# EasyEDA Pro project sfy3-v3.1.4.epro, board PCB_sfy3_1_3
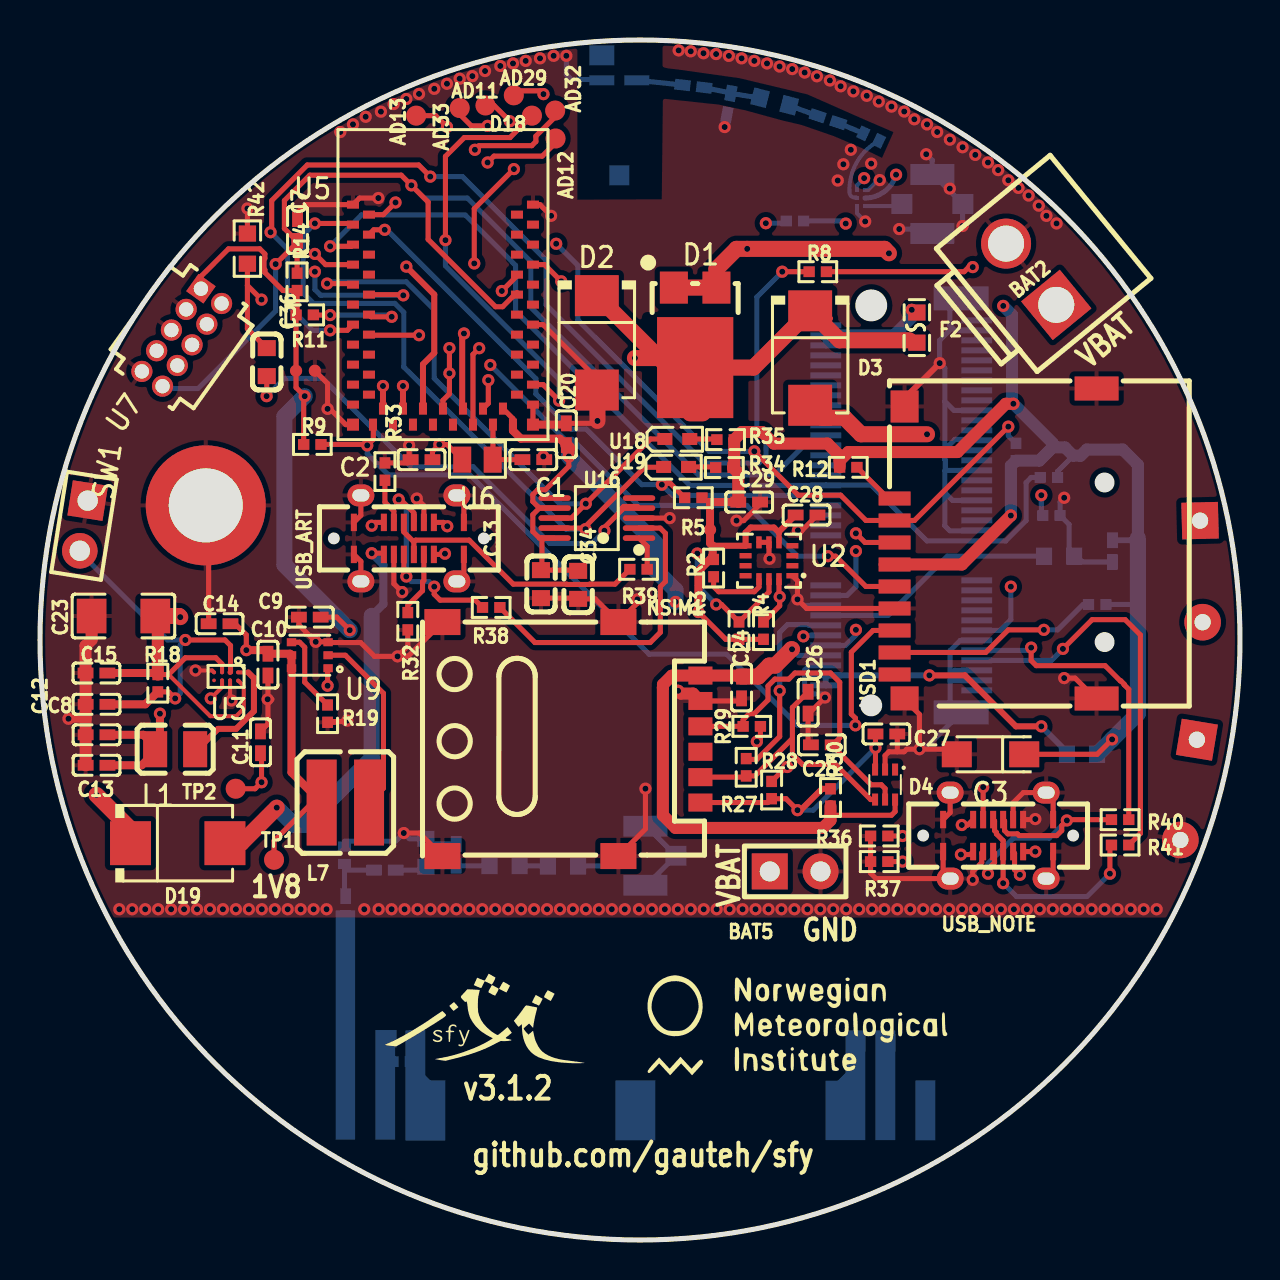
[diagram p36: board, top side]
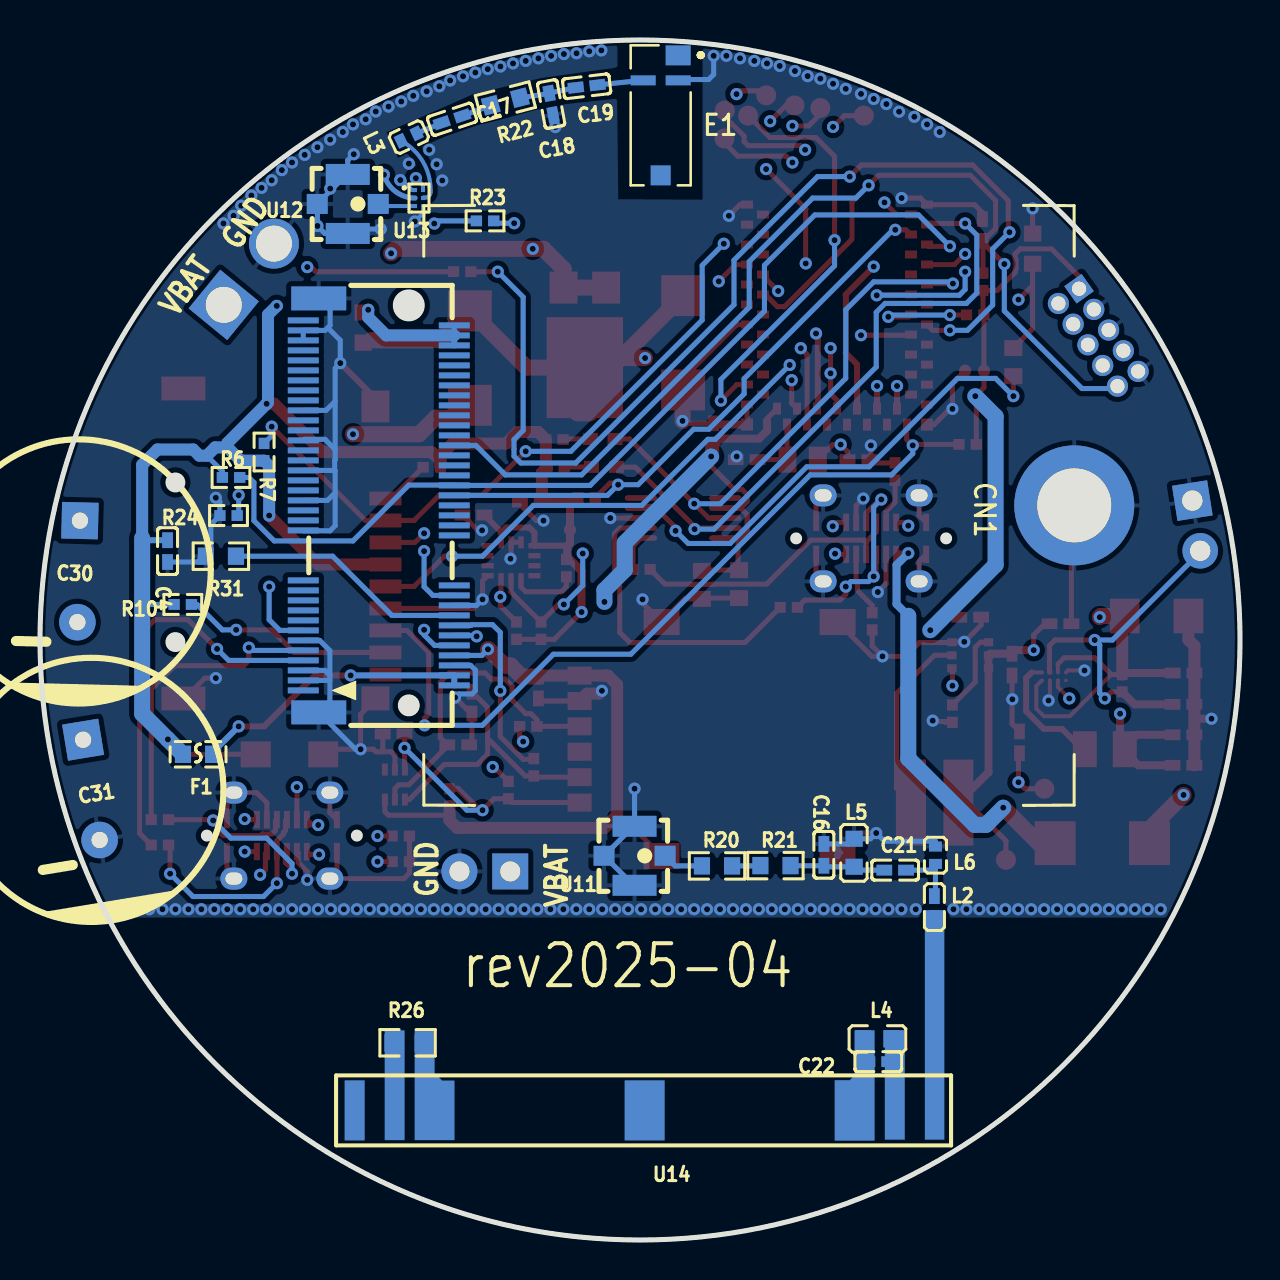
[diagram p37: board, bottom side, seen from below]

Outline 60 x 60 mm; copper layers: Top Layer, GND, POWER, Bottom Layer. Coordinates in mm from the lower left corner of the outline.
Outline path: circle c30,30 r30
Stack: Top Layer 0.035mm 外层铜厚1oz / Dielectric1 0.2104mm 7628 RC49% 8.6mil / GND 0.0152mm 内层铜厚 / Dielectric2 1.065mm 1.1mm H/HOZ 含铜 / POWER 0.0152mm 内层铜厚 / Dielectric3 0.2104mm 7628 RC49% 8.6mil / Bottom Layer 0.035mm 外层铜厚1oz

## Design rules (mm)
template: User Custom Config
spacing Default (default): track to track 0.152, other pairs 0 to 0.152
track width Default (default): min 0.2, default 0.254, max 25.4
differential pair differentialPair (default): width min 0.127, default 0.254, max 2.54; gap min 0.152, default 0.152
via Default (default): diameter min 0.61, default 0.61, max 100.025; hole min 0.305, default 0.305, max 59.995

## Placement (name value [footprint] x y rotation side)
AD11  -  [Test_Point1]  22.27 56.73 0 top
AD12  -  [Test_Point1]  25.78 55.08 0 top
AD13  -  [Test_Point1]  18.81 56.22 0 top
AD29  -  [Test_Point1]  23.69 57.23 0 top
AD32  -  [Test_Point1]  25.76 56.47 0 top
AD33  -  [Test_Point1]  20.99 56.6 0 top
BAT2  B2P-VH-BL(LF)(SN)  [CONN-TH-2P-P3.96_B2P-VH-BL-LF-SN]  49.56 48.29 129.3 top
BAT5  BAT  [HDR-TH_2P-P2.54-V-M-1]  37.76 18.43 0 top
C1  15pF  [C0402]  24.67 39.02 0 top
C2  15pF  [C0402]  19.08 39.02 180 top
C3  10uF  [CAP-SMD_L3.2-W1.6-RD]  47.53 24.28 180 top
C4  100nF  [C0402]  53.62 34.45 90 bottom
C7  1nF  [C0402]  12.88 50.5 90 top
C8  100nF  [C0402]  2.83 26.78 180 top
C9  100nF  [C0402]  13.49 31.14 180 top
C10  100nF  [C0402]  11.4 28.77 270 top
C11  10uF  [C0402]  11.02 24.88 90 top
C12  10uF  [C0402]  2.83 25.26 180 top
C13  10uF  [C0402]  2.83 23.74 180 top
C14  10uF  [C0402]  8.98 30.81 180 top
C15  4.7uF  [C0402]  2.82 28.35 0 top
C16  1pF  [C0402]  20.81 19.26 270 bottom
C17  1nF  [C0402]  39.4 56.03 161.6 bottom
C18  4.6pF  [C0402]  34.45 56.8 79.5 bottom
C19  1.1pF  [C0402]  32.67 57.69 173.3 bottom
C20  1uF  [C0402]  26.32 40.29 270 top
C21  2.2pF  [C0402]  17.24 18.49 180 bottom
C22  0.5pF  [C0402]  18.09 8.92 0 bottom
C23  47uF  [C1206]  4.17 31.2 0 top
C24  100nF  [C0402]  35.08 27.63 270 top
C25  33pF  [C0402]  39.09 24.76 0 top
C26  33pF  [C0402]  38.41 26.87 90 top
C27  33pF  [C0402]  42.32 25.3 180 top
C28  100nF  [C0402]  38.33 36.25 0 top
C29  100nF  [C0402]  35.46 36.9 0 top
C30  10F  [CP_12.5X20MM]  58.07 33.43 1.4 bottom
C31  10F  [CP_12.5X20MM]  57.43 22.51 350.6 bottom
C33  0.1uF  [C0603]  25.05 32.79 270 top
C34  10nF  [C0603]  26.91 32.76 270 top
C36  0.1uF  [C0603]  11.34 43.9 270 top
CN1  NOTECARD CONNECTOR  [NOTECARD-ext]  9.81 36.73 270 bottom
D1  FSV1045V  [TO-277A_L6.1-W4.6-P2.13-LS6.5-TR]  32.76 45.62 90 top
D2  SM6T6V8A  [SMB_L4.6-W3.6-LS5.3-RD]  27.84 44.86 270 top
D3  STPS3H100U  [SMB_L4.6-W3.6-LS5.3-RD]  38.51 44.1 270 top
D4  CESDLC5V0M5  [SOT-563_L1.6-W1.2-P0.50-LS1.6-BR]  42.25 22.77 90 top
D18  -  [Test_Point1]  24.6 56.22 0 top
D19  STPS3H100U  [SMB_L4.6-W3.6-LS5.3-RD]  6.89 19.84 0 top
E1  -  [NN03-320]  28.97 56.23 90 bottom
F1  046701.5NRHF  [F0603]  52.1 24.28 0 bottom
F2  F0603FA3500V032T  [F0603]  43.84 45.62 270 top
L1  2.2uH  [L0806]  6.76 24.54 0 top
L2  2.3nH  [L0402]  15.28 16.65 270 bottom
L3  7.5nH  [IND-SMD_L1.0-W0.6]  41.56 55.15 154.7 bottom
L4  12nH  [L0603]  18.14 10.06 0 bottom
L5  10nH  [L0603]  19.29 19.36 90 bottom
L6  8.4nH  [IND-SMD_L1.0-W0.6]  15.23 19.24 90 bottom
L7  2.2uH  [IND-SMD_L4.0-W4.0_XAL4040-103]  15.27 21.87 180 top
NOREF  -  [Pad_e1148]  12.8 43.46 0 top
NOREF#2  -  [Pad_e50]  33.5 35.51 0 top
NOREF#3  -  [Pad_e1168]  13.74 43.46 0 top
NSIM1  SMN-305  [SIM-SMD_SMN-305]  26.57 25.05 270 top
R2  10kΩ  [R0402]  33.68 33.59 90 top
R3  10kΩ  [R0402]  34.95 30.47 270 top
R4  10kΩ  [R0402]  36.18 30.47 270 top
R5  10kΩ  [R0402]  32.67 37.11 0 top
R6  10kΩ  [R0402]  50.45 38.13 0 bottom
R7  10kΩ  [R0402]  48.8 39.4 270 bottom
R8  10kΩ  [R0402]  38.89 48.42 0 top
R9  10kΩ  [R0402]  13.62 39.78 180 top
R10  10kΩ  [R0402]  52.86 31.78 0 bottom
R11  10kΩ  [R0402]  13.24 46.26 180 top
R12  10kΩ  [R0402]  40.41 38.64 180 top
R14  100kΩ  [R0402]  12.86 47.91 270 top
R18  10MΩ  [R0402]  5.89 27.84 90 top
R19  82kΩ  [R0402]  14.38 26.32 90 top
R20  0Ω  [R0603]  26.15 18.7 180 bottom
R21  0Ω  [R0603]  23.23 18.72 180 bottom
R22  0Ω  [R0603]  36.73 56.92 165.5 bottom
R23  200kΩ  [R0402]  37.75 50.95 180 bottom
R24  100kΩ  [R0402]  50.57 36.22 180 bottom
R26  0Ω  [R0603]  41.62 9.86 0 bottom
R27  22Ω  [R0402]  36.58 22.5 270 top
R28  22Ω  [R0402]  35.31 23.64 270 top
R29  22Ω  [R0402]  35.59 25.68 180 top
R30  15kΩ  [R0402]  39.53 22.13 270 top
R31  0Ω  [R0603]  50.96 34.19 0 bottom
R32  5.1kΩ  [R0402]  18.39 30.94 90 top
R33  5.1kΩ  [R0402]  17.25 38.42 270 top
R34  1K  [R0402]  34.22 38.62 0 top
R35  1K  [R0402]  34.28 40.02 0 top
R36  5.1kΩ  [R0402]  41.96 20.2 0 top
R37  5.1kΩ  [R0402]  41.96 18.92 0 top
R38  22Ω  [R0402]  22.56 31.63 180 top
R39  22Ω  [R0402]  29.93 33.53 180 top
R40  22Ω  [R0402]  54 21.02 180 top
R41  22Ω  [R0402]  54 19.75 180 top
R42  220K  [R0603]  10.37 49.57 270 top
SW1  M.sw.  [2P]  2.19 35.72 261.1 top
TP1  -  [TESTPOINT-1MM]  11.7 19.01 0 top
TP2  -  [Test-Point-0.5mm]  9.79 22.56 0 top
U2  ISM330DHCXTR  [LGA-14_L3.0-W2.5-P0.50-BR]  36.45 33.96 0 top
U3  TPS62748YFPT  [DSBGA-8_L1.6-W0.9-R2-C4-P0.40-BL]  9.3 28.18 180 top
U5  SPARKFUN ARTEMIS BLE MODULE  [ARTEMIS_BLE]  15.65 40.77 90 top
U6  32.768kHz  [CRYSTAL-SMD_L2.0-W1.2]  21.87 39.02 180 top
U7  FTSH-105-01-F-D-K  [CONN-TH_10P-P1.27_FTSH-105-01-F-D-K]  7.09 45.13 234.5 top
U9  MAX17225ELT+T  [UDFN-6_L2.0-W2.0-P0.65-BL]  13.49 29.24 90 top
U11  CONMHF1-SMD-G-T  [RF-SMD_CONMHF1-SMD-G-T]  30.27 19.21 270 bottom
U12  CONMHF1-SMD-G-T  [RF-SMD_CONMHF1-SMD-G-T]  44.61 51.8 270 bottom
U13  BGA725L6E6327FTSA1  [TSLP-6_L1.1-W0.7-P0.40-BR]  41.05 52.1 0 bottom
U14  -  [NN03-310-NoSilk]  15.27 6.5 0 bottom
U16  CH340E  [MSOP-10_L3.0-W3.0-P0.50-LS5.0-BL]  27.84 36.1 90 top
U18  YLED0402Y  [LED0402-R-RD]  31.87 40.05 0 top
U19  YLED0402G  [LED0402-R-RD]  31.81 38.65 0 top
USB_ART  TYPE-C 16PLT-H10.0  [TYPE-C-SMD_USB4120-03-C]  18.44 35.08 180 top
USB_NOTE  TYPE-C 16PLT-H10.0  [TYPE-C-SMD_USB4120-03-C]  47.91 20.22 0 top
USD1  TF-CARD H1.8  [TF-SMD_TF-CARD-H1.8]  47.78 34.83 90 top

## Footprints (pads in the part's own frame, mm; a bottom-side part is the same pattern mirrored in y, then rotated)
2P
  rect 1.778x1.778 hole 1.016: 1(-1.27,0)
  round 1.778 hole 1.016: 2(1.27,0)
ARTEMIS_BLE
  rect 0.4x0.6 smd: 1(11,0) 2(10.5,-0.8) 3(10,0) 4(9.5,-0.8) 5(9,0) 6(8.5,-0.8) 7(8,0) 8(7.5,-0.8) 9(7,0) 10(6.5,-0.8) 11(6,0) 12(5.5,-0.8) 13(5,0) 14(4.5,-0.8) 15(4,0) 16(3.5,-0.8) 17(3,0) 18(2.5,-0.8) 19(2,0) 20(1.5,-0.8) 21(1,0) 39(1,-8.999) 40(1.5,-8.2) 41(2,-8.999) 42(2.5,-8.2) 43(3,-8.999) 44(3.5,-8.2) 45(4,-8.999) 46(4.5,-8.2) 47(5,-8.999) 48(5.5,-8.2) 49(6,-8.999) 50(6.5,-8.2) 51(7,-8.999) 52(7.5,-8.2) 53(8,-8.999) 54(8.5,-8.2) 55(9,-8.999) 56(9.5,-8.2) 57(10,-8.999) 58(10.5,-8.2) 59(11,-8.999)
  rect 0.6x0.6 smd: 22(0,0) 38(0,-8.999)
  rect 0.6x0.4 smd: 23(0,-1) 24(0.8,-1.5) 25(0,-2) 26(0.8,-2.5) 27(0,-2.999) 28(0.8,-3.5) 29(0,-3.999) 30(0.8,-4.5) 31(0,-5) 32(0.8,-5.5) 33(0,-6) 34(0.8,-6.5) 35(0,-7) 36(0.8,-7.5) 37(0,-8)
C0402
  rect 0.79x0.54 smd: 1(-0.545,0) 2(0.545,0)
C0603
  rect 0.8x0.9 smd: 1(-0.7,0) 2(0.7,0)
C1206
  rect 1.485x1.728 smd: 1(-1.593,0) 2(1.593,0)
CAP-SMD_L3.2-W1.6-RD
  rect 1.5x1.296 smd: 1(-1.687,0) 2(1.687,0)
CONN-TH-2P-P3.96_B2P-VH-BL-LF-SN
  rect 2.5x2.5 hole 1.8: 1(-1.98,0)
  round 2.5 hole 1.8: 2(1.98,0)
CONN-TH_10P-P1.27_FTSH-105-01-F-D-K
  rect 1.06x1.06 hole 0.715x0.71: 1(-2.54,-0.635)
  round 1.06 hole 0.715x0.71: 2(-2.54,0.635) 3(-1.27,-0.635) 4(-1.27,0.635) 5(0,-0.635) 6(0,0.635) 7(1.27,-0.635) 8(1.27,0.635) 9(2.54,-0.635) 10(2.54,0.635)
CP_12.5X20MM
  rect 1.829x1.829 hole 0.813: 1(0,-2.54)
  round 1.829 hole 0.813: 2(0,2.54)
CRYSTAL-SMD_L2.0-W1.2
  rect 0.9x1.3 smd: 1(-0.762,0) 2(0.762,0)
DSBGA-8_L1.6-W0.9-R2-C4-P0.40-BL
  round 0.184 smd: A1(-0.6,-0.2) A2(-0.6,0.2) B1(-0.2,-0.2) B2(-0.2,0.2) C1(0.2,-0.2) C2(0.2,0.2) D1(0.6,-0.2) D2(0.6,0.2)
F0603
  rect 0.806x0.864 smd: 1(-0.753,0) 2(0.753,0)
HDR-TH_2P-P2.54-V-M-1
  rect 1.8x1.8 hole 1: 1(-1.27,0)
  round 1.8 hole 1: 2(1.27,0)
IND-SMD_L1.0-W0.6
  rect 0.5x0.648 smd: 1(-0.434,0) 2(0.434,0)
IND-SMD_L4.0-W4.0_XAL4040-103
  rect 1.5x4.3 smd: 1(-1.185,0) 2(1.185,0)
L0402
  rect 0.79x0.54 smd: 1(-0.545,0) 2(0.545,0)
L0603
  rect 0.8x0.864 smd: 1(-0.7,0) 2(0.7,0)
L0806
  rect 1.2x1.8 smd: 1(-1,0) 2(1,0)
LED0402-R-RD
  rect 0.75x0.6 smd: 1(0.623,0) 2(-0.623,0)
LGA-14_L3.0-W2.5-P0.50-BR
  rect 0.6x0.27 smd: 1(1.17,-0.75) 2(1.17,-0.25) 3(1.17,0.25) 4(1.17,0.75) 8(-1.17,0.75) 9(-1.17,0.25) 10(-1.17,-0.25) 11(-1.17,-0.75)
  rect 0.27x0.6 smd: 5(0.5,0.92) 6(0,0.92) 7(-0.5,0.92) 12(-0.5,-0.92) 13(0,-0.92) 14(0.5,-0.92)
MSOP-10_L3.0-W3.0-P0.50-LS5.0-BL
  oval 0.28x1.62 smd: 1(-1,-2.11) 2(-0.5,-2.11) 3(0,-2.11) 4(0.5,-2.11) 5(1,-2.11) 6(1,2.11) 7(0.5,2.11) 8(0,2.11) 9(-0.5,2.11) 10(-1,2.11)
NN03-310-NoSilk
  custom 0.97x11.48 smd: 1(0.003,-4.242)
  custom 0.992x5.499 smd: 2(1.994,-1.238)
  custom 2.001x5.513 smd: 3(4,-1.22)
  rect 2x3 smd: 4(14.5,0.025)
  custom 1.986x5.486 smd: 5(25.003,-1.232)
  custom 0.992x5.486 smd: 6(27,-1.232)
  rect 1x3 smd: 7(29,0.025)
NN03-320
  rect 1x1 smd: 1(-3,0)
  custom 0.5x1.25 smd: 2(1.75,-0.875) 4(1.75,0.875)
  custom 1x1.25 smd: 3(3,-0.875)
NOTECARD-ext
  round 6 hole 3.7: 0(0,1.524)
  rect 0.3x1.55 smd: 1(9.25,-37.025) 2(9,-29.475) 3(8.751,-37.025) 4(8.5,-29.475) 5(8.25,-37.025) 6(8,-29.475) 7(7.75,-37.025) 8(7.5,-29.475) 9(7.25,-37.025) 10(7,-29.475) 11(6.75,-37.025) 12(6.5,-29.475) 13(6.25,-37.025) 14(6,-29.475) 15(5.75,-37.025) 16(5.5,-29.475) 17(5.25,-37.025) 18(5,-29.475) 19(4.75,-37.025) 20(4.5,-29.475) 21(4.25,-37.025) 22(4,-29.475) 23(3.751,-37.025) 32(1.5,-29.475) 33(1.25,-37.025) 34(1,-29.475) 35(0.75,-37.025) 36(0.5,-29.475) 37(0.25,-37.025) 38(0.001,-29.475) 39(-0.249,-37.025) 40(-0.5,-29.475) 41(-0.75,-37.025) 42(-1,-29.475) 43(-1.25,-37.025) 44(-1.5,-29.475) 45(-1.75,-37.025) 46(-2,-29.475) 47(-2.249,-37.025) 48(-2.5,-29.475) 49(-2.75,-37.025) 50(-2.999,-29.475) 51(-3.249,-37.025) 52(-3.5,-29.475) 53(-3.75,-37.025) 54(-3.999,-29.475) 55(-4.25,-37.025) 56(-4.5,-29.475) 57(-4.75,-37.025) 58(-5,-29.475) 59(-5.25,-37.025) 60(-5.5,-29.475) 61(-5.75,-37.025) 62(-6,-29.475) 63(-6.25,-37.025) 64(-6.5,-29.475) 65(-6.75,-37.025) 66(-7,-29.475) 67(-7.25,-37.025) 68(-7.5,-29.475) 69(-7.75,-37.025) 70(-8,-29.475) 71(-8.249,-37.025) 72(-8.5,-29.475) 73(-8.75,-37.025) 74(-8.999,-29.475) 75(-9.249,-37.025)
  rect 1.2x2.75 smd: 76(-10.35,-36.25) 77(10.35,-36.25)
Pad_e50
  round 0.61 smd: TP1(0,0)
Pad_e1148
  round 0.61 smd: TP1(0,0)
Pad_e1168
  round 0.61 smd: TP3(0,0)
R0402
  rect 0.566x0.54 smd: 1(-0.433,0) 2(0.433,0)
R0603
  rect 0.806x0.864 smd: 1(-0.753,0) 2(0.753,0)
RF-SMD_CONMHF1-SMD-G-T
  rect 1x1.05 smd: 1(0,1.525) 4(0,-1.525)
  rect 1.05x2.2 smd: 2(-1.475,0) 3(1.475,0)
SIM-SMD_SMN-305
  rect 1.3x1.8 smd: 1(5.85,-6.45) 2(-5.85,-6.45) 3(5.85,2.35) 4(-5.85,2.35)
  rect 0.9x1.2 smd: C1(-3.175,6.45) C2(-0.635,6.45) C3(1.905,6.45) C5(-1.905,6.45) C6(0.635,6.45) C7(3.175,6.45)
SMB_L4.6-W3.6-LS5.3-RD
  rect 2.047x2.192 smd: 1(-2.361,0) 2(2.361,0)
SOT-563_L1.6-W1.2-P0.50-LS1.6-BR
  rect 0.6x0.3 smd: 1(0.75,-0.5) 2(0.75,0) 3(0.75,0.5) 4(-0.75,0.5) 5(-0.75,0) 6(-0.75,-0.5)
Test-Point-0.5mm
  round 1 smd: 1(0,0)
Test_Point1
  round 1 smd: 1(0,0)
TESTPOINT-1MM
  round 1 smd: 1(0,0)
TF-SMD_TF-CARD-H1.8
  rect 0.7x1.6 smd: 1(2.25,5.05) 2(1.15,5.05) 3(0.05,5.05) 4(-1.05,5.05) 5(-2.15,5.05) 6(-3.25,5.05) 7(-4.35,5.05) 8(-5.45,5.05) 9(-6.55,5.05)
  rect 1.2x1.4 smd: 10(-7.747,4.55)
  rect 1.2x2.2 smd: 11(-7.75,-5.05) 12(7.75,-5.05)
  rect 1.6x1.4 smd: 13(6.85,4.55)
TO-277A_L6.1-W4.6-P2.13-LS6.5-TR
  rect 1.6x1.4 smd: 1(2,1.065) 2(2,-1.065)
  rect 5.05x3.81 smd: 3(-2,0)
TSLP-6_L1.1-W0.7-P0.40-BR
  rect 0.2x0.2 smd: 1(0.2,-0.4) 2(0.2,0) 3(0.2,0.4) 4(-0.2,0.4) 5(-0.2,0) 6(-0.2,-0.4)
TYPE-C-SMD_USB4120-03-C
  oval 1.35x1.1 hole 0.85x0.6: 0(-2.4,2.15) 0(-2.4,-2.15) 0(2.4,2.15) 0(2.4,-2.15)
  rect 0.3x0.87 smd: A1(-2.75,0.8) A4(-1.25,0.8) A5(-0.75,0.8) A6(-0.25,0.8) A7(0.25,0.8) A8(0.75,0.8) A9(1.25,0.8) A12(2.75,0.8) B1(2.75,-0.8) B4(1.25,-0.8) B5(0.75,-0.8) B6(0.25,-0.8) B7(-0.25,-0.8) B8(-0.75,-0.8) B9(-1.25,-0.8) B12(-2.75,-0.8)
UDFN-6_L2.0-W2.0-P0.65-BL
  rect 0.4x0.47 smd: 1(-0.65,-0.915) 2(0,-0.915) 3(0.65,-0.915) 4(0.65,0.915) 5(0,0.915) 6(-0.65,0.915)

## Nets
As in the schematic, except:
+3V3: C3.1 C4.2 C9.1 C11.1 C20.2 C28.1 C29.1 C33.1 C34.1 F1.2 NOREF.TP1 NOREF#2.TP1 R2.2 R3.2 R4.2 R5.2 R6.2 R7.2 R8.2 R9.2 R10.2 R11.2 R12.2 R14.2 R34.2 R35.2 TP2.1 U2.5 U2.8 U5.36 U5.37 U7.1 U9.1 U13.2 U16.7 U16.10 USD1.4
GND: BAT2.2 BAT5.2 C1.2 C2.2 C3.2 C4.1 C7.2 C8.2 C9.2 C10.2 C11.2 C12.2 C13.2 C14.2 C15.1 C16.1 C18.1 C20.1 C23.1 C24.2 C25.1 C26.1 C27.1 C28.2 C29.2 C31.2 C33.2 C34.2 CN1.0 CN1.3 CN1.5 CN1.6 CN1.11 CN1.18 CN1.33 CN1.39 CN1.45 CN1.51 CN1.57 CN1.71 CN1.73 CN1.76 CN1.77 D2.2 D4.2 E1.2 L5.2 L6.2 NOREF#3.TP3 NSIM1.1 NSIM1.2 NSIM1.3 NSIM1.4 NSIM1.C5 R19.1 R24.1 R31.2 R32.1 R33.1 R36.1 R37.1 R42.1 SW1.1 U2.1 U2.6 U2.7 U3.B2 U3.D1 U5.1 U5.22 U5.38 U5.39 U5.47 U5.59 U7.3 U7.5 U7.9 U9.3 U11.2 U11.3 U11.4 U12.2 U12.3 U12.4 U13.1 U13.4 U16.3 USB_ART.0 USB_ART.A1 USB_ART.A8 USB_ART.A12 USB_ART.B1 USB_ART.B8 USB_ART.B12 USB_NOTE.0 USB_NOTE.A1 USB_NOTE.A8 USB_NOTE.A12 USB_NOTE.B1 USB_NOTE.B8 USB_NOTE.B12 USD1.6 USD1.10 USD1.11 USD1.12 USD1.13

Pads without a net: CN1 1 15 17 19 21 22 23 32 34 35 36 37 38 41 43 44 46 47 48 49 52 53 54 55 56 58 59 60 61 62 63 64 65 66 67 68 69 75; D4 1; E1 1 3; NSIM1 C6; U2 2 3 4 9 10 11; U3 D2; U5 6 8 11 15 16 17 18 19 20 21 25 27 29 31 40 42 43 44 45 46 48 49 51 54 55 57 58; U7 7 8; U14 4 7; U16 5 6; USD1 9

## Via types
v1: diameter 0.61, hole 0.305, Top Layer to Bottom Layer, 291 vias

## Routing (per net, layer and track width the routed paths; a pad name or vN(x,y) marks a point on that pad's centre or on a via; arc(x,y) is an arc through that point)
1V8: length 31.3
  Top Layer w0.2: v1(8.54,27.08) 9.1,27.65 9.1,27.98
  Top Layer w0.254: v1(10.32,29.49) 10.32,30.25 9.76,30.81 C14.1 ; 11.71,19.08 11.7,19.09 11.7,19.96 13.62,21.87 L7.2
  Top Layer w0.4: v1(6,26.32) 6,24.65 5.89,24.54 ; 5.89,24.54 5.17,25.26 3.37,25.26 ; 5.89,24.54 5.08,23.74 3.37,23.74 ; v1(10.32,29.49) 11.22,29.49 C10.1 12.5,29.31 U9.5 U9.6 12.58,23.38 L7.2
  POWER w0.4: v1(6,26.32) 7.78,26.32 v1(8.54,27.08) 8.54,28.48 9.55,29.49 v1(10.32,29.49)
+3V3: length 194.7
  Top Layer w0.254: 25.13,33.49 25.1,33.53 25.1,35.1 ; 25.13,33.49 C33.1 ; 25.13,33.49 26.87,33.49 C34.1 ; 12.86,46.31 R14.2 12.15,47.47 11.24,48.38 11.24,48.51 11.2,48.55 11.2,49.04 11.24,49.08 11.24,49.3 10.99,49.56 9.43,49.56 8.05,48.18 U7.1 ; 12.86,46.31 12.86,46.26 ; 12.86,46.31 R11.2 NOREF.TP1 12.8,42.62 v1(13.24,42.19) 13.18,42.14 R9.2 ; 26.44,39.07 26.44,38.69 25.27,37.52 24.89,37.52 24.64,37.27 24.64,36.92 24.97,36.6 ; v1(14.38,27.71) 14.38,28.56 U9.1 ; 24.97,36.6 U16.7 ; 24.97,36.6 24.64,36.27 24.64,35.42 24.97,35.1 25.1,35.1 ; U5.37 23.65,41.07 U5.36 ; R2.2 33.68,34.66 ; R4.2 R3.2 34.28,30.03 v1(32.92,31.4) ; C9.1 14.83,31.14 v1(15.49,30.49) ; 25.1,35.1 U16.10 ; C3.1 52.86,24.28 v1(53.61,25.03) ; TP2.1 10.75,22.56 v1(11.08,22.89) 11.08,24.29 C11.1 ; 36.95,35.37 U2.5 ; v1(46.64,48.65) 46.44,48.65 46.21,48.42 R8.2 ; 33.43,36.97 33.5,36.9
  Top Layer w0.3: C28.1 36.95,35.42 36.95,35.37 36.7,35.62 35.53,35.62 35.28,35.37 U2.8 33.73,34.71 33.68,34.66
  Top Layer w0.4: v1(32.92,31.4) 32.92,33.44 33.06,33.58 33.06,33.59 33.64,34.17 33.64,34.69 33.64,34.7 33.5,34.84 NOREF#2.TP1 33.5,36.9 C29.1 ; 26.25,39.81 25.99,40.07 24.05,40.07 23.65,40.47 U5.37
  Top Layer w0.6: 39.98,38.96 40.42,39.4 45.88,39.4 48.29,41.81 v1(48.67,41.81) ; 39.98,38.96 39.98,39.22 39.38,39.82 36.69,39.82 36.11,40.4 35.09,40.4 R35.2 34.71,38.68 R34.2 34.91,38.36 C29.1 ; 39.98,38.96 R12.2 ; v1(48.54,36.22) 46.09,33.78 42.23,33.78 ; v1(26.44,39.18) 26.44,39.62 C20.2
  POWER w0.254: v1(32.92,31.4) 32.79,31.4
  POWER w0.6: v1(48.16,46.7) 48.16,47.12 v1(46.64,48.65) 44.73,50.55 44.73,52.73 44.2,53.26 v1(42.8,53.26)
  POWER w0.8: v1(31.78,31.91) 32.41,31.91 v1(32.92,31.4)
  POWER w1: 15.49,28.31 14.89,27.71 v1(14.38,27.71) 13.74,27.71 11.08,25.05 v1(11.08,22.89) ; 15.49,28.31 15.49,30.34 ; 15.49,28.31 15.49,28.13 15.65,27.97 27.84,27.97 v1(31.78,31.91)
  Bottom Layer w0.254: R6.2 50.88,38.43 51.66,39.21 ; R10.2 54.89,31.78 ; U13.2 arc(42.22,52.42) v1(42.8,53.26)
  Bottom Layer w0.3: 54.89,35.09 54.79,34.99 C4.2
  Bottom Layer w0.6: 50.63,39.63 51.24,39.63 51.66,39.21 52.03,39.21 52.34,39.53 54.13,39.53 54.89,38.76 54.89,35.09 ; 50.63,39.63 50.63,39.85 v1(48.67,41.81) 48.6,41.88 48.6,46.26 v1(48.16,46.7) ; 50.63,39.63 49.96,38.97 R7.2 48.54,38.71 v1(48.54,36.22)
  Bottom Layer w0.8: 54.89,35.09 54.89,26.32 v1(53.61,25.03) 52.86,24.28 F1.2 ; v1(15.49,30.49) 12.22,33.76 12.22,41.18 v1(13.24,42.19) ; v1(26.44,39.18) 30.76,34.86 30.76,33.5 31.78,32.49 v1(31.78,31.91)
GND: length 193.6
  Top Layer w0.2: 8.7,28.38 8.61,28.48 v1(7.78,28.48) ; 9.5,27.98 9.5,27.05 v1(9.57,26.98)
  Top Layer w0.254: v1(34.83,35.97) 35.19,35.97 36,36.79 36,36.9 ; USB_ART.0 16.04,36.23 USB_ART.B1 ; 11.4,27.02 C10.2 ; 11.4,27.02 11.4,25.8 C11.2 ; 11.4,27.02 11.58,27.02 11.6,27.04 ; 15.4,25.94 15.38,25.92 14.75,25.92 ; C3.2 45.59,24.54 v1(43.97,24.54) ; USB_ART.B8 19.19,36.72 v1(18.84,37.07) ; U5.59 25,51.77 v1(25.56,51.21) ; C9.2 12.95,30.75 v1(13.79,29.91) 14.38,29.91 U9.3 14.42,29.87 16.03,29.87 16.72,29.18 v1(17.88,29.18) ; NSIM1.3 30.27,20.55 v1(30.27,22.57) ; v1(43.97,24.54) 43.34,24.54 43.21,24.41 42.86,24.41 ; v1(43.97,24.54) 43.97,26.28 43.23,27.03 ; D4.2 42.25,24.22 42.45,24.41 42.86,24.41 ; v1(16.92,52.1) 15.98,52.1 U5.1 13.27,51.77 12.88,51.37 C7.2 ; 42.23,31.58 38.33,31.58 v1(37.87,32.03) 37.87,32.96 U2.1 ; C1.2 25.21,39.13 v1(25.17,39.18) ; NOREF#3.TP3 14.38,42.83 v1(14.38,41.56) 14.5,41.56 15.29,40.77 U5.22 ; v1(29.87,32.03) 29.87,31.85 NSIM1.4 27.76,32.06 C34.2 26.87,32.09 C33.2 ; v1(10.37,51.58) R42.1 ; USB_ART.0 16.04,33.93 USB_ART.A12 ; USB_ART.0 21.19,36.88 USB_ART.B12 ; v1(51.21,28.09) 51.76,28.09 52.83,27.03 ; USB_NOTE.A12 50.66,22.02 USB_NOTE.0 49.17,22.37 48.66,21.86 USB_NOTE.A8 ; USB_NOTE.B8 47.09,19.35 47.09,18.87 46.64,18.42 v1(46.64,18.01) ; USB_NOTE.B1 50.66,18.42 USB_NOTE.0 ; NSIM1.1 18.97,20.35 v1(18.19,20.35) ; NSIM1.C5 34.95,26.95 C24.2 ; USB_ART.0 21.19,33.28 USB_ART.A1 ; 14.75,25.92 14.71,25.88 R19.1 ; 14.75,25.92 14.33,25.92 ; 42.86,24.41 C27.1 ; USB_NOTE.B12 45.16,18.42 USB_NOTE.0 41.8,18.07 41.53,18.34 R37.1 R36.1 ; C20.1 27.75,40.83 v1(27.87,40.95) ; USB_NOTE.0 45.51,21.37 USB_NOTE.A1 ; U5.47 25.15,45.77 27.84,43.08 D2.2 ; v1(18.11,32.4) 17.69,32.81 USB_ART.A8 ; C25.1 38.41,24.9 C26.1 38.45,26.32 v1(39.25,27.12) ; R32.1 18.39,29.69 v1(17.88,29.18) ; v1(18.46,39.73) 18.46,39.09 C2.2 18.37,38.85 R33.1 ; C14.2 8.43,36.59 CN1.0 ; v1(17.88,29.18) 18.41,29.18 NSIM1.2 ; v1(37.9,35.48) 38.11,35.48 38.87,36.25 ; U16.3 v1(31.49,36.1) ; U2.7 U2.6 36.45,34.09 v1(36.48,34.06) ; U5.39 U5.38
  Top Layer w0.3: v1(44.99,43.84) 43.23,42.08 43.23,41.68
  Top Layer w0.4: v1(1.43,26.06) 2.26,26.06 2.28,26.08 ; C20.1 26.25,40.77 U5.38
  Top Layer w0.6: C13.2 C12.2 C8.2 2.28,28.34 C15.1 2.28,29.71 2.58,30.01 C23.1 ; v1(31.91,27.46) 32.04,27.32 32.65,27.32 NSIM1.C5
  Top Layer w0.8: D2.2 27.87,42.47 v1(27.87,40.95)
  Bottom Layer w0.2: v1(41.99,53) 41.78,53 41.78,52.88 41.4,52.5 U13.1 ; v1(41.26,50.93) 40.85,51.34 U13.4
  Bottom Layer w0.254: CN1.51 46.78,40.03 45.75,40.03 45.24,39.53 ; v1(30.27,22.57) U11.2 30.32,20.69 U11.4 30.32,17.74 U11.3 ; CN1.45 45.27,38.48 ; 45.27,38.48 45.24,38.45 45.24,37.37 ; 45.27,38.48 45.27,38.99 45.24,39.02 45.24,39.53 ; 44.66,53.28 U12.2 44.61,53.99 v1(44.31,54.29) ; 44.66,53.28 44.78,53.28 v1(45.49,52.57) ; 44.66,53.28 U12.4 46.13,51.79 v1(46.13,50.7) 45.75,50.33 U12.3 44.39,50.55 v1(42.96,50.55) ; 45.24,37.37 45.63,36.98 CN1.39 ; 45.24,37.37 45.24,35.72 45.49,35.46 46.82,35.46 CN1.33 ; v1(43.97,24.54) 44.22,24.54 46.06,26.38 45.51,26.94 45.51,27.98 ; CN1.11 46.02,29.98 45.51,29.47 45.51,28.23 ; 28.09,57.98 28.05,58.02 26.57,58.02 26.32,58.28 v1(26.32,59.21) ; v1(39.25,27.12) 39.07,27.3 38.4,27.3 38.23,27.47 38.23,28.5 38.47,28.73 CN1.6 ; CN1.76 45.49,46.51 45.49,45.73 45.75,45.48 CN1.73 CN1.71 ; v1(51.21,37.11) 51.01,36.91 R24.1 51.45,35.78 51.45,34.57 52.13,33.9 C4.1 ; 34.35,56.26 34.35,55.76 v1(34.23,55.65) ; v1(44.99,43.84) 45.24,43.59 45.24,41.94 ; 45.51,28.23 45.51,27.98 ; 45.51,28.23 45.75,28.48 CN1.5 ; 45.51,27.98 CN1.3 ; 45.24,39.53 45.24,41.94 ; 44.99,43.87 44.99,44.99 45.49,45.49 ; C16.1 19.55,19.8 L5.2 18.47,20.06 v1(18.19,20.35) 17.78,19.94 15.23,19.94 ; 45.24,41.94 45.7,41.48 CN1.57 ; v1(37.87,32.03) 38.18,31.73 CN1.18
  Bottom Layer w0.3: v1(44.99,43.84) 44.99,43.87
  vias: v1(3.97,16.54) v1(4.61,16.54) v1(5.26,16.54) v1(5.91,16.54) v1(6.56,16.54) v1(7.2,16.54) v1(7.85,16.54) v1(8.5,16.54) v1(9.15,16.54) v1(9.79,16.54) v1(10.44,16.54) v1(11.09,16.54) v1(11.38,27.04) v1(11.74,16.54) v1(12.39,16.54) v1(13.03,16.54) v1(13.68,16.54) v1(14.33,16.54) v1(15.01,55.4) v1(15.36,25.97) v1(15.65,55.78) v1(16.21,16.54) v1(16.28,56.16) v1(16.93,16.54) v1(17.05,56.42) v1(17.58,16.54) v1(17.68,56.8) v1(18.23,16.54) v1(18.32,57.05) v1(18.88,16.54) v1(18.95,57.31) v1(19.52,16.54) v1(19.71,57.56) v1(20.17,16.54) v1(20.35,57.81) v1(20.82,16.54) v1(20.98,58.07) v1(21.47,16.54) v1(21.62,58.19) v1(22.11,16.54) v1(22.25,58.45) v1(22.76,16.54) v1(23.02,58.7) v1(23.41,16.54) v1(23.65,58.83) v1(24.06,16.54) v1(24.28,58.96) v1(24.7,16.54) v1(25,59.08) v1(25.35,16.54) v1(25.68,59.21) v1(26,16.54) v1(26.65,16.54) v1(27.3,16.54) v1(27.94,16.54) v1(28.59,16.54) v1(29.24,16.54) v1(29.95,16.54) v1(30.59,16.54) v1(31.24,16.54) v1(31.93,59.48) v1(31.89,16.54) v1(32.54,59.43) v1(32.54,16.54) v1(33.18,59.34) v1(33.19,16.54) v1(33.81,59.3) v1(33.83,16.54) v1(34.44,59.21) v1(34.48,16.54) v1(35.08,59.08) v1(35.13,16.54) v1(35.72,58.96) v1(35.78,16.54) v1(36.35,58.83) v1(36.42,16.54) v1(36.98,58.68) v1(37.07,16.54) v1(37.61,58.55) v1(37.72,16.54) v1(38.23,58.37) v1(38.37,16.54) v1(38.85,58.19) v1(39.01,16.54) v1(39.49,57.98) v1(39.66,16.54) v1(39.89,52.97) v1(40.03,57.69) v1(40.17,53.79) v1(40.31,16.54) v1(40.54,54.51) v1(40.67,57.43) v1(40.96,16.54) v1(41.34,57.21) v1(41.56,53.82) v1(41.61,16.54) v1(41.94,56.92) v1(42.22,16.54) v1(42.57,56.67) v1(42.87,16.54) v1(43.21,56.42) v1(43.51,16.54) v1(43.72,56.03) v1(44.16,16.54) v1(44.35,55.78) v1(44.86,55.4) v1(44.81,16.54) v1(45.46,16.54) v1(45.49,55.02) v1(46.13,54.64) v1(46.1,16.54) v1(46.76,54.26) v1(46.75,16.54) v1(47.4,53.88) v1(47.4,16.54) v1(47.91,53.5) v1(48.05,16.54) v1(48.42,52.99) v1(48.69,16.54) v1(48.92,52.61) v1(49.34,16.54) v1(49.43,52.23) v1(49.94,51.72) v1(49.99,16.54) v1(50.32,51.21) v1(50.64,16.54) v1(50.83,50.83) v1(51.28,16.54) v1(51.93,16.54) v1(52.58,16.54) v1(53.23,16.54) v1(53.88,16.54) v1(54.54,16.54) v1(55.18,16.54) v1(55.83,16.54)
VBAT: length 77.1
  Top Layer w0.8: v1(42.45,49.33) 42.22,49.56 v1(35.36,49.56) 34.83,49.56 33.82,48.56 D1.2 D1.1
  POWER w0.4: 36.49,18.3 36.49,19.6 36.99,20.09 39.27,20.09 43.08,23.9 43.08,30.89 41.63,32.34 39.6,32.34 37.24,34.7 37.24,43.21 35.59,44.86 35.59,49.33 v1(35.36,49.56)
  POWER w1: BAT2.1 50.81,45.97 ; 50.81,45.97 48.81,43.97 47.81,43.97 v1(42.45,49.33) ; 50.81,45.97 50.81,43.16 C30.1
BOOT: length 11.4
  Top Layer w0.254: 10.37,47.72 R42.2 ; 10.37,47.72 v1(11.08,47.02) ; 10.37,47.72 10.37,45.56 C36.1 ; U5.7 14.28,48.77 v1(13.74,49.3)
  POWER w0.254: v1(13.74,49.3) 13.36,49.3 v1(11.08,47.02)
CC1_ART: length 3.2
  Top Layer w0.254: R32.2 18.39,31.73 19.13,32.47 19.13,32.91 19.19,32.98 USB_ART.A5
CC1_NOTE: length 9.3
  Top Layer w0.254: v1(47.16,22.64) USB_NOTE.A5 ; v1(43.13,20.2) 42.39,20.2
  POWER w0.254: v1(43.13,20.2) 43.13,22.42 44.1,23.4 46.41,23.4 v1(47.16,22.64)
CC2_ART: length 2.3
  Top Layer w0.254: 17.25,37.99 17.25,36.89 17.69,36.44 USB_ART.B5
CC2_NOTE: length 10.1
  Top Layer w0.254: v1(49,18.26) 48.98,18.26 48.73,18.51 48.73,19.34 48.66,19.41 USB_NOTE.B5 ; 42.39,18.92 v1(43.13,18.92)
  POWER w0.254: v1(43.13,18.92) 43.13,17.64 43.59,17.17 48.32,17.17 49,17.85 v1(49,18.26)
I_CS: length 3.4
  Top Layer w0.254: U2.12 35.95,32.65 35.72,32.41 33.94,32.41 33.68,32.67 R2.1
I_SCL: length 28
  Top Layer w0.254: U5.53 25.23,48.77 v1(26.06,47.93) ; v1(33.81,31.78) 34.07,31.78 R3.1 36.45,32.4 U2.13
  POWER w0.254: v1(26.06,47.93) 29.21,47.93 33.81,43.34 33.81,35.27 v1(32.86,34.32)
  Bottom Layer w0.254: v1(32.86,34.32) 32.86,32.72 v1(33.81,31.78)
I_SDA: length 30.1
  Top Layer w0.254: U2.14 36.95,32.2 v1(36.99,32.16) 36.99,31.71 R4.1 ; U5.52 23.85,48.21 v1(23.09,47.45)
  POWER w0.254: v1(23.09,47.45) 23.19,47.35 28.78,47.35 32.29,43.84 32.29,34.57 32.28,34.57 32.28,34.08 32.29,34.08 32.29,33.17 32.54,32.92 34.32,32.92 35.08,32.16 v1(36.99,32.16)
NC_SCL: length 30.4
  Top Layer w0.254: v1(31.09,37.77) 31.17,37.84 31.51,37.84 R5.1 ; U5.4 16.69,50.51 v1(17.24,50.51)
  Bottom Layer w0.254: CN1.40 31.63,37.23 v1(31.09,37.77) 30.09,37.77 27.32,40.54 26.56,40.54 24.79,42.31 24.79,43.07 17.35,50.51 v1(17.24,50.51)
NC_SDA: length 47.9
  Top Layer w0.254: v1(14.51,49.69) 15.56,49.69 U5.5
  Bottom Layer w0.254: R6.1 49.56,38.13 49.3,37.87 49.3,35.97 48.29,34.95 44.35,34.95 41.56,37.75 39.3,37.75 CN1.42 32.49,37.73 23.78,46.45 23.78,48.73 21.26,51.25 16.07,51.25 v1(14.51,49.69)
NRESET: length 60.2
  Top Layer w0.254: 13,49.95 12.94,49.89 ; 12.86,49.81 R14.1 ; 12.69,49.81 12.69,50.1 12.22,50.57 12.22,51.97 13.49,53.24 18.06,53.24 v1(18.57,52.73) 19.41,51.9 19.41,50.03 22.77,46.66 23.13,46.66 23.68,47.21 23.68,47.27 U5.50 23.85,47.37 ; C7.1 12.88,49.89 v1(11.78,48.8)
  Bottom Layer w0.254: v1(11.78,48.8) 11.78,46.45 7.9,42.57 6.25,42.57 U7.10 ; CN1.50 38.21,39.73 36.73,38.26 32.92,38.26 24.54,46.64 24.54,48.92 21.36,52.1 19.21,52.1 v1(18.57,52.73)
RTS: length 24.4
  Top Layer w0.254: C36.2 11.34,42.2 v1(11.33,42.19) ; U16.4 29.87,36.68 29.18,36.68 29.11,36.6 29.11,36.52 28.22,35.63 v1(28.22,35.46)
  Bottom Layer w0.254: v1(11.33,42.19) 12.22,43.08 14.12,43.08 18.55,38.66 21.66,38.66 25.49,34.83 27.59,34.83 v1(28.22,35.46)
SD_CD: length 45.5
  Top Layer w0.254: v1(35.72,39.43) 37.91,37.24 40.03,37.24 41.3,35.98 USD1.2 43.72,35.98 v1(48.42,40.67) ; U5.14 16.48,45.24 v1(18.95,45.24)
  POWER w0.254: v1(18.95,45.24) 18.95,46.89 22.38,50.32 25.3,50.32 v1(25.81,49.81)
  Bottom Layer w0.254: v1(48.42,40.67) 48.42,40.21 R7.1 ; v1(25.81,49.81) 26.89,48.73 26.89,46 33.46,39.43 v1(35.72,39.43)
SD_MISO: length 39.9
  Top Layer w0.254: 16.36,39.73 16.41,39.78 ; 16.41,39.78 16.67,40.03 16.67,40.75 U5.23 ; 16.41,39.78 14.18,39.78 14.05,39.91 ; v1(40.77,25.73) 40.77,26.09 40.57,26.3 40.57,29.39 41.65,30.48 42.23,30.48
  Bottom Layer w0.254: v1(40.77,25.73) 37.89,25.73 34.33,29.29 30.46,29.29 21.49,38.26 17.43,38.26 16.36,39.32 v1(16.36,39.73)
SD_MOSI: length 70.2
  Top Layer w0.254: 42.23,34.88 41.25,34.88 v1(40.8,35.33) ; v1(11.53,50.39) 11.53,50.4 11.59,50.46 11.59,51.97 13.36,53.75 18.93,53.75 v1(19.51,53.17) ; U5.13 15.36,45.48 v1(14.51,45.48) ; v1(37.11,48.42) R8.1
  POWER w0.254: v1(37.11,48.42) 37.11,47.15 40.31,43.94 40.31,35.59 40.57,35.33 v1(40.8,35.33)
  Bottom Layer w0.254: v1(19.51,53.17) 21.12,53.17 25.3,48.99 25.3,46.76 33.21,38.85 35.96,38.85 36.3,39.19 36.3,39.54 36.3,40.02 35.84,40.48 35.84,47.15 v1(37.11,48.42) ; v1(14.51,45.48) 13.63,45.48 12.37,46.74 12.37,49.55 v1(11.53,50.39)
SD_SCK: length 35.8
  Top Layer w0.254: v1(39.4,34.19) 39.78,34.19 41.29,32.68 42.23,32.68 ; U5.12 16.56,46.16 v1(17.59,46.16) ; v1(14.51,46.25) 13.68,46.25 R11.1
  POWER w0.254: v1(17.59,46.16) 17.59,45.46 19.04,44.01 22.18,44.01 22.43,43.75 v1(22.52,43.75)
  Bottom Layer w0.254: v1(22.52,43.75) 26.23,40.03 26.61,40.03 29.91,36.73 35.33,36.73 37.87,34.19 v1(39.4,34.19) ; v1(17.59,46.16) 17.5,46.25 v1(14.51,46.25)
SIM_CLK: length 9.8
  Top Layer w0.254: R28.1 35.35,24.03 35.84,24.03 36.99,25.17 v1(36.99,27.46)
  Bottom Layer w0.254: CN1.14 38.45,30.73 38.41,30.77 37.37,30.77 36.99,30.38 v1(36.99,27.46)
SIM_DAT2: length 2.1
  Top Layer w0.254: 42.23,37.08 42.23,37.26 R12.1
SIM_IO: length 9.2
  Top Layer w0.254: v1(37.37,23.65) 37.3,23.65 R27.1
  POWER w0.254: v1(38.17,30.18) 38.2,30.15 38.2,28.43 37.62,27.84 37.62,23.9 v1(37.37,23.65)
  Bottom Layer w0.254: v1(37.37,23.65) 37.37,23.52 ; v1(38.17,30.18) 38.22,30.23 CN1.12
SIM_RST: length 17.5
  Top Layer w0.254: v1(35.84,24.92) 36.02,25.1 R29.1
  POWER w0.254: v1(35.84,24.92) 35.84,22.63 36.1,22.38 39.41,22.38 40.16,23.13 40.16,29.87 v1(40.8,30.51)
  Bottom Layer w0.254: CN1.10 40.27,29.73 40.8,30.25 v1(40.8,30.51)
SIM_VCC: length 29
  Top Layer w0.254: 39.53,21.24 42.57,21.24 42.75,21.42 D4.6
  Top Layer w0.6: C24.1 35.03,28.22 NSIM1.C1 31.74,28.22 31.74,28.22 31.59,28.22 31.15,27.77 31.15,27.63 31.14,27.62 31.14,21.24 31.78,20.6 39.14,20.6 39.53,20.98 R30.2
  Top Layer w0.8: C24.1 35.91,28.17 36.46,28.72 36.76,28.72 37.58,29.54 v1(37.6,29.54)
  Bottom Layer w0.254: v1(37.6,29.54) 37.91,29.23 CN1.8
SWDCLK: length 14.4
  Top Layer w0.254: U5.2 17.17,51.27 v1(17.78,51.88)
  POWER w0.254: U7.4 13.15,45.79 15.4,48.04 15.4,49.5 v1(17.78,51.88)
SWDIO: length 13
  Top Layer w0.254: U5.10 18.13,47.27 v1(18.16,47.23)
  POWER w0.254: U7.2 9.62,46.83 10.19,46.26 11.59,46.26 v1(13.74,48.42)
  Bottom Layer w0.254: v1(13.74,48.42) 13.74,47.53 14.03,47.24 18.16,47.24 v1(18.16,47.23)
SWO: length 33.6
  Top Layer w0.254: 20.73,56.54 21.57,55.71 v1(22.38,55.71) ; v1(21.71,48.83) 21.71,51.56 v1(23.69,53.55) ; U5.30 20.15,41.98 20.47,42.31 v1(20.47,43.33) v1(20.47,44.59)
  POWER w0.254: v1(20.47,43.33) 18.06,40.92 11.44,40.92 7.6,44.76 ; v1(22.38,55.71) 23.69,54.39 v1(23.69,53.55) ; v1(20.47,44.59) 20.47,47.59 v1(21.71,48.83)
USB_RX_ART: length 33.1
  Top Layer w0.254: U16.9 27.22,35.6 v1(27.27,35.54) 27.27,35.68 30.23,38.64 31.16,38.64 U19.2 ; v1(13.74,50.83) 15.59,50.83 U5.3
  Bottom Layer w0.254: v1(13.74,50.83) 13.16,50.24 13.16,47.35 13.68,46.83 17.74,46.83 18.19,46.38 18.19,43.65 26.3,35.54 v1(27.27,35.54)
USB_TX_ART: length 28
  Top Layer w0.254: U5.9 15.6,47.82 v1(14.35,47.82) ; U18.2 30.53,40.05 v1(27.29,36.81) 26.57,36.1 U16.8
  Bottom Layer w0.254: v1(14.35,47.82) 14.44,47.91 18.32,47.91 19.71,46.51 19.71,43.08 25.98,36.81 v1(27.29,36.81)
USBD+: length 20.1
  Top Layer w0.254: R41.1 55.02,20.33 55.02,30.25 54.26,31.02 52.61,31.02 v1(51.15,29.56)
  Bottom Layer w0.254: v1(51.15,29.56) 50.57,28.98 CN1.7
USBD-: length 15.4
  Top Layer w0.254: v1(49.56,29.62) 49.56,28.97 49.81,28.72 53.25,28.72 54.02,27.95 54.05,27.95 54.21,27.79 54.21,27.76 54.44,27.53 R40.1
  Bottom Layer w0.254: v1(49.56,29.62) 49.42,29.48 CN1.9
VACT_GPS_OUT: length 22.9
  POWER w0.254: v1(40.8,34.45) 40.54,34.45 39.65,35.33 39.65,42.57 36.29,45.93 v1(36.29,50.84)
  Bottom Layer w0.254: R23.2 37.2,50.84 v1(36.29,50.84) ; CN1.20 40.36,32.23 40.8,32.67 v1(40.8,34.45)
VMAIN: length 88.8
  Top Layer w0.2: 6.43,28.27 8.51,26.19 9.81,26.19 10.19,26.57 10.19,27.7 9.93,27.95 9.91,27.95 ; 9.1,28.38 9.1,28.8
  Top Layer w0.254: 32.15,41.68 31.96,41.87 ; 32.15,41.68 32.73,41.11 ; 32.15,41.68 32.15,42.06 ; 37.9,45.85 38.18,46.08 39.53,46.08 ; 9.1,28.8 8.79,29.11 7.27,29.11 6.43,28.27 R18.2
  Top Layer w0.4: C15.2 5.82,28.35 R18.2
  Top Layer w0.6: R18.2 5.89,31.08 5.77,31.2
  Top Layer w0.8: 43.46,44.99 39.98,44.99 38.89,46.08 ; 37.9,45.85 35.67,43.62 D1.3 ; D1.3 31.44,43.62 30.96,44.1 ; D1.3 32.28,44.1 30.96,44.1 ; v1(29.75,44.1) 30.96,44.1 ; 30.96,44.1 D2.1 ; 5.77,31.2 6.96,31.2 v1(7.01,31.14) ; D19.1 4.53,20.55 v1(2.82,22.25) ; 32.5,41.33 33.14,41.33
  POWER w0.8: v1(29.75,44.1) 25.43,44.1 23.14,41.81 23.14,32.84 21.7,31.4 7.27,31.4 v1(7.01,31.14) 2.82,26.95 v1(2.82,22.25)
VUSB: length 42.7
  Top Layer w0.254: USB_NOTE.B4 v1(49.76,19.42) ; USB_NOTE.A9 49.74,21.02 v1(49.76,21.05) ; v1(46.09,20.75) 46.39,20.75 USB_NOTE.A4 ; v1(46.05,19.27) 46.51,19.27 USB_NOTE.B9
  Top Layer w0.8: v1(44.35,40.29) 41.05,40.29 40.22,41.11 39.13,41.11 D3.2
  POWER w0.254: 46.05,20.23 46.06,20.22 49.76,20.22 ; 46.05,20.23 46.05,20.71 v1(46.09,20.75) ; 46.05,20.23 v1(46.05,19.27) ; 49.76,20.22 v1(49.76,21.05) ; 49.76,20.22 v1(49.76,19.42)
  POWER w0.8: v1(49.76,21.05) 48.92,21.89 48.92,24.54 46.76,26.7 46.76,31.4 48.03,32.67 v1(48.54,32.67) 44.35,36.86 v1(44.35,40.29)
  Bottom Layer w0.254: v1(48.54,32.67) 48.54,31.02 48.01,30.48 CN1.13
VUSB_ART: length 29.7
  Top Layer w0.254: USB_ART.B9 20.17,35.88 v1(20.36,35.69) ; v1(16.59,34.34) 17.13,34.34 USB_ART.A9 ; USB_ART.B4 16.75,35.88 v1(16.59,35.72) ; USB_ART.A4 20.21,34.28 v1(20.25,34.32)
  Top Layer w0.8: D19.2 10.06,19.84 v1(11.84,21.62)
  POWER w0.254: v1(16.59,35.72) v1(16.59,34.34) 20.23,34.34 v1(20.25,34.32) 20.36,34.43 v1(20.36,35.69)
  Bottom Layer w0.4: 16.59,31.21 17.17,31.8 17.17,33.75 v1(16.59,34.34)
  Bottom Layer w0.8: v1(11.84,21.62) 12.7,20.76 13.27,20.76 16.59,24.07 16.59,31.21
$1N5: length 6.1
  Bottom Layer w0.254: CN1.72 CN1.74
  Bottom Layer w0.3: CN1.72 CN1.70
  Bottom Layer w0.6: v1(43.59,46.51) 43.59,46.13 42.69,45.23 CN1.72
$1N27: length 12.1
  Bottom Layer w0.254: R31.1 45.37,34.19 42.41,31.23 CN1.16
$1N1900: length 1.9
  Bottom Layer w0.2: U12.1 42.98,51.7 U13.3
$1N1978: length 2.4
  Bottom Layer w0.254: 32.13,57.75 29.78,58
$1N2069: length 3.7
  Bottom Layer w0.2: U13.5 40.83,52.12 40.75,52.12 arc(40.55,52.2) 40.47,52.4 40.47,52.5 arc(40.87,53.94) L3.1
$1N2072: length 1.4
  Bottom Layer w0.254: 41.17,55.33 39.9,55.85
$1N2075: length 1.5
  Bottom Layer w0.254: 38.89,56.2 37.45,56.73
$1N2105: length 2.8
  Bottom Layer w0.254: 33.23,57.62 34.55,57.34 ; 34.55,57.33 35.95,57.1
$1N2207: length 25.4
  POWER w0.254: v1(41.21,53.09) 40.29,52.17 v1(40.29,50.82) 39.91,50.44 39.91,46 48.67,37.24 v1(50.07,37.24)
  Bottom Layer w0.2: v1(41.21,53.09) 40.85,52.74 U13.6
  Bottom Layer w0.254: v1(40.29,50.82) 40.15,50.95 R23.1 ; v1(50.07,37.24) 50.07,36.3 R24.2
$1N3253: length 2.1
  Bottom Layer w0.254: 26.9,18.7 28.24,18.7 U11.1
$1N3261: length 1.4
  Bottom Layer w0.254: R20.2 24,18.7 R21.1
$1N3697: length 4.8
  Bottom Layer w0.254: R21.2 22.47,18.71 C16.2 20.76,18.66 L5.1 19.12,18.49 17.79,18.49
$1N3711: length 2.9
  Bottom Layer w0.254: C21.2 15.27,18.49 15.23,18.54 15.23,17.25 L2.1
$1N3824: length 14.3
  Top Layer w0.3: v1(50.07,25.68) 48.8,25.68 46.25,28.23 v1(44.47,28.23)
  Bottom Layer w0.3: F1.1 51.34,24.4 v1(50.07,25.68) ; v1(44.47,28.23) CN1.4 CN1.2
$2N19158: length 10.7
  Top Layer w0.254: v1(50.19,30.51) 48.42,30.51 47.28,29.38 USD1.8
  Bottom Layer w0.254: R10.1 52.15,31.78 50.88,30.51 v1(50.19,30.51)
$3N3: length 8.1
  Top Layer w0.254: U5.34 22.42,41.84 v1(22.42,42.99) ; C2.1 19.62,39.43 v1(19.97,39.77) 20.35,39.77 U6.2
  POWER w0.254: v1(22.42,42.99) 22.38,42.95 22.38,42.19 v1(19.97,39.77)
$3N4: length 3.2
  Top Layer w0.254: U5.35 22.65,39.03 U6.1 C1.1
$3N3757: length 21.5
  Top Layer w0.254: AD11.1 22.71,56.73 v1(23.49,55.94)
  Top Layer w0.3: v1(21.2,45.33) 21.18,45.33 21.14,45.28 21.14,45.14 21.11,45.11 21.11,41.61 U5.32
  POWER w0.254: v1(21.2,45.33) 21.2,47.49 22.89,49.18 26.32,49.18 26.57,49.43 26.57,51.08 24.41,53.24 24.41,55.02 v1(23.49,55.94)
$3N3767: length 19.3
  Top Layer w0.254: AD12.1 25.84,55.14 25.88,55.14 25.97,55.05 25.11,54.19 22.7,54.19 v1(22.38,53.88)
  Top Layer w0.3: U5.26 v1(18.15,42.7)
  POWER w0.254: v1(22.38,53.88) 17,48.5 17,43.85 v1(18.15,42.7)
$3N3770: length 20.4
  Top Layer w0.254: AD13.1 19.78,56.22 v1(20.35,55.65)
  Top Layer w0.3: U5.28 19.15,43.79 19.71,44.35 19.71,47.27 v1(18.32,48.67)
  POWER w0.254: v1(20.35,55.65) 21.55,55.65 23.02,54.19 23.02,53.67 18.32,48.97 v1(18.32,48.67)
$3N3773: length 22.9
  Top Layer w0.254: 24.07,57.46 25.01,57.46 v1(25.17,57.29) ; U5.33 21.65,44.28 v1(21.96,44.59)
  POWER w0.254: v1(21.96,44.59) 21.96,47.36 23.12,48.52 26.55,48.52 27.08,49.05 27.08,51.34 25.81,52.61 25.81,56.92 25.44,57.29 v1(25.17,57.29)
$3N3776: length 20.8
  Top Layer w0.254: v1(21.75,54.51) 21.95,54.72 24.59,54.72 24.79,54.92 24.79,55.19 25.76,56.16 AD32.1
  Top Layer w0.3: U5.24 v1(17.15,42.7)
  POWER w0.254: v1(17.15,42.7) 16.16,43.69 16.16,48.54 21.75,54.13 v1(21.75,54.51)
$3N3779: length 21.4
  Top Layer w0.254: U5.41 25.16,42.77 v1(25.96,41.97) ; v1(20.27,49.99) 20.27,54.18 21.21,55.12 23.5,55.12 D18.1
  Bottom Layer w0.254: v1(20.27,49.99) 20.27,48.71 25.96,43.03 v1(25.96,41.97)
$4N6: length 6.2
  Top Layer w0.2: 10.41,28.38 9.9,28.38
  Top Layer w0.3: 10.41,28.38 10.7,28.09 10.7,26.44 9.81,25.56 8.9,25.56 7.89,24.54
$4N11: length 9.3
  Top Layer w0.254: U9.2 15.27,29.24 17.17,27.33 17.17,22.59 L7.1
$4N1576: length 4.1
  Top Layer w0.254: R19.2 13.24,27.89 13.24,29.63 12.98,29.89 U9.4
$4N2482: length 17
  Top Layer w0.254: 9.5,28.38 9.53,28.4 9.53,29.72 9.25,30 v1(7.27,30) ; R18.1 6.43,27.41 v1(6.76,27.08)
  Top Layer w0.4: 3.37,26.78 5.27,26.78 R18.1
  Bottom Layer w0.254: v1(6.76,27.08) 7.01,27.33 7.01,29.75 v1(7.27,30) 6.38,30 2.5,33.88
$4N17108: length 6
  POWER w1: 57.84,25.01 58.13,25.3 C30.2
$5N5765: length 16.3
  Top Layer w0.254: D4.5 42.25,22.57 42.06,22.76 41.56,22.76 39.64,24.68 C25.2 39.99,25.11 39.99,27.89 39.53,28.35 37.75,28.35 37.44,28.04 36.74,28.04 36.4,27.7 36.4,27 35.72,26.32 35.46,26.32 35.16,26.01 R29.2 NSIM1.C2
$5N5772: length 13.9
  Top Layer w0.254: D4.4 41.53,22.02 39.78,23.78 38.13,23.78 37.62,24.28 37.62,25.08 ; 37.62,25.08 35.75,23.2 R28.2 35.25,23.14 NSIM1.C3 ; 37.62,25.08 37.62,26.62 C26.2
$5N5779: length 14.2
  Top Layer w0.254: NSIM1.C7 36.39,21.87 R27.2 37.3,22.06 v1(37.87,21.49) ; 41.77,25.3 v1(41.77,24.61) 41.77,23.54 D4.3
  Top Layer w0.3: R30.1 39.1,22.56 38.03,21.49 v1(37.87,21.49)
  Bottom Layer w0.254: v1(41.77,24.61) 38.66,21.49 v1(37.87,21.49)
$5N13425: length 1.4
  Top Layer w0.254: R34.1 33.75,38.65 U19.1
$5N13426: length 1.4
  Top Layer w0.254: U18.1 33.81,40.05 R35.1
$5N13679: length 10.9
  Top Layer w0.254: USB_NOTE.A6 47.73,20.95 47.73,20.47 47.82,20.38 47.82,20.3 48.16,19.97 USB_NOTE.B6 v1(48.16,17.84) ; v1(53.5,18.32) 53.5,19.67 R41.2
  Bottom Layer w0.254: v1(48.16,17.84) 48.82,17.17 52.35,17.17 v1(53.5,18.32)
$5N13680: length 13.1
  Top Layer w0.254: R40.2 51.38,21.02 v1(51.34,20.98) 51.09,20.72 51.09,20.47 50.84,20.22 48.96,20.22 48.87,20.31 48.39,20.31 48.23,20.47 48.23,20.95 USB_NOTE.A7 ; USB_NOTE.B7 47.73,19.35 47.73,18.87 47.4,18.54 v1(47.4,18.32)
  Bottom Layer w0.254: v1(47.4,18.32) 47.4,18.82 48.67,20.09 50.46,20.09 v1(51.34,20.98)
$5N13766: length 15.4
  Top Layer w0.254: 22.99,31.63 24.75,29.87 30.51,29.87 31.02,30.38 31.02,32.67 31.27,32.92 31.27,35.33 31.01,35.6 U16.2
$5N13775: length 11.4
  Top Layer w0.254: v1(18.32,33.17) 18.19,33.3 USB_ART.A7 ; v1(17.94,37.03) 18.03,37.03 18.69,36.36 USB_ART.B7 ; R38.2 21.76,32 20,32 19.71,32.29 v1(19.71,32.67)
  Bottom Layer w0.254: v1(17.94,37.03) 18.32,36.65 v1(18.32,33.17) 18.57,32.92 19.46,32.92 v1(19.71,32.67) 19.81,32.67
$5N13822: length 13.9
  Top Layer w0.254: USB_ART.A6 18.69,34.9 ; 18.69,34.9 18.19,35.4 18.19,35.88 USB_ART.B6 ; 18.69,34.9 18.79,34.99 21.46,34.99 23.66,32.79 26.33,32.79 26.34,32.78 27.47,32.78 27.49,32.79 28.75,32.79 R39.2
$5N13825: length 1.5
  Top Layer w0.254: U16.1 30.36,34.69 30.36,33.79
$1N3308: length 7
  Bottom Layer w0.254: 15.26,15.96 15.27,15.95 15.27,8.97
$1N9751: length 1.8
  Bottom Layer w0.254: 40.82,9.86 40.82,8.1

## Copper pours and planes (outline as drawn; the poured copper is in the pictures)
GND on Top Layer: 42.1,54.11 42.67,55.39 40.96,56.13 38.36,57.28 35.01,58.08 31.84,58.53 31.4,58.58 31.13,58.65 31.13,60.27 31.12,60.27 31,60.27 30.87,60.4 50.05,59.56 60.59,49.02 60.59,18.79 57.92,16.12 1.66,16.12 -0.88,18.66 -0.88,46.6 12.84,60.32 26.48,60.32 26.87,60.71 26.87,52.02 31.09,52.04 31.14,57.07 33.94,56.77 35.29,56.48 37.11,55.98 38.09,55.75 39.7,55.19 41.13,54.58
GND on Bottom Layer: 42.1,54.11 42.67,55.39 40.96,56.13 38.36,57.28 35.01,58.08 31.84,58.53 31.4,58.58 31.13,58.65 31.13,60.27 31.12,60.27 31,60.27 30.87,60.4 50.05,59.56 60.59,49.02 60.59,18.79 57.92,16.12 1.66,16.12 -0.88,18.66 -0.88,46.6 12.84,60.32 26.48,60.32 26.87,60.71 26.87,52.02 31.09,52.04 31.14,57.07 33.94,56.77 35.29,56.48 37.11,55.98 38.09,55.75 39.7,55.19 41.13,54.58
GND on GND: 42.1,54.11 42.67,55.39 40.96,56.13 38.36,57.28 35.01,58.08 31.84,58.53 31.4,58.58 31.13,58.65 31.13,60.27 31.12,60.27 31,60.27 30.87,60.4 50.05,59.56 60.59,49.02 60.59,18.79 57.92,16.12 1.66,16.12 -0.88,18.66 -0.88,46.6 12.84,60.32 26.48,60.32 26.87,60.71 26.87,52.02 31.09,52.04 31.14,57.07 33.94,56.77 35.29,56.48 37.11,55.98 38.09,55.75 39.7,55.19 41.13,54.58

## Text on the board
Bottom Silkscreen Layer: VBAT | GND | rev2025-04
Top Silkscreen Layer: VBAT | GND | 1V8 | v3.1.2 | github.com/gauteh/sfy
